# EAGLE board FINAL COMMON BOARD (EAGLE 9.5.2)
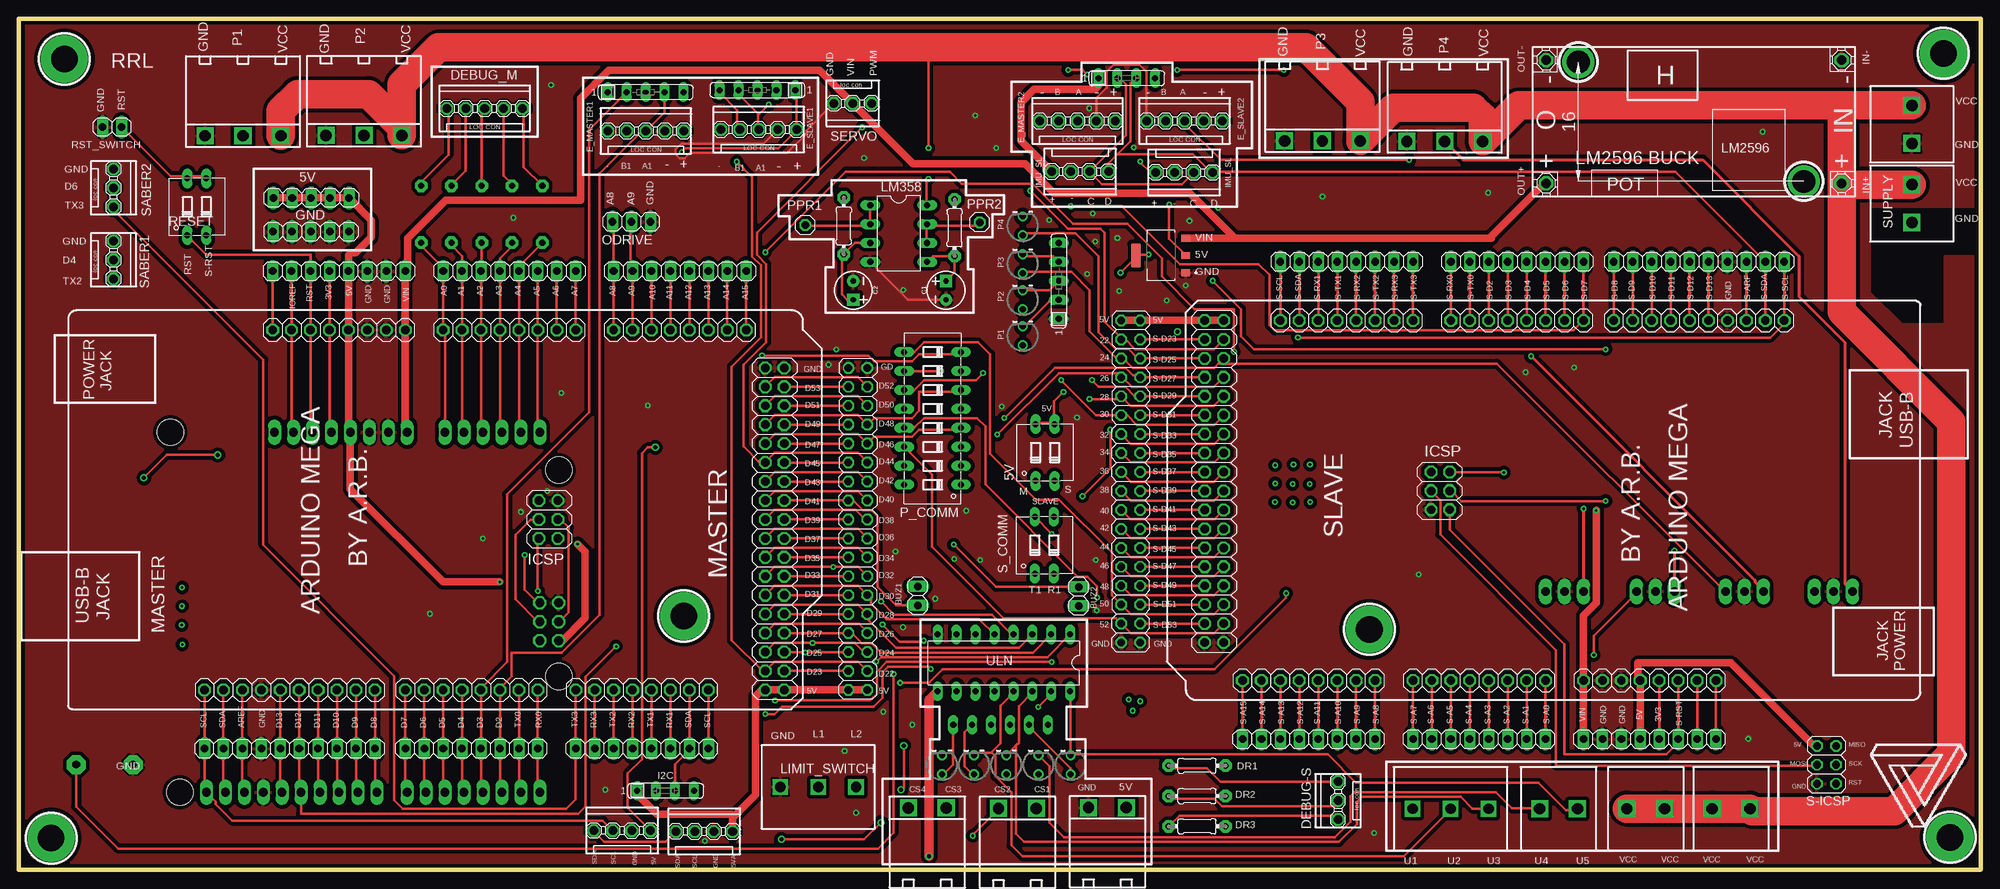
[diagram p2: board, top side]
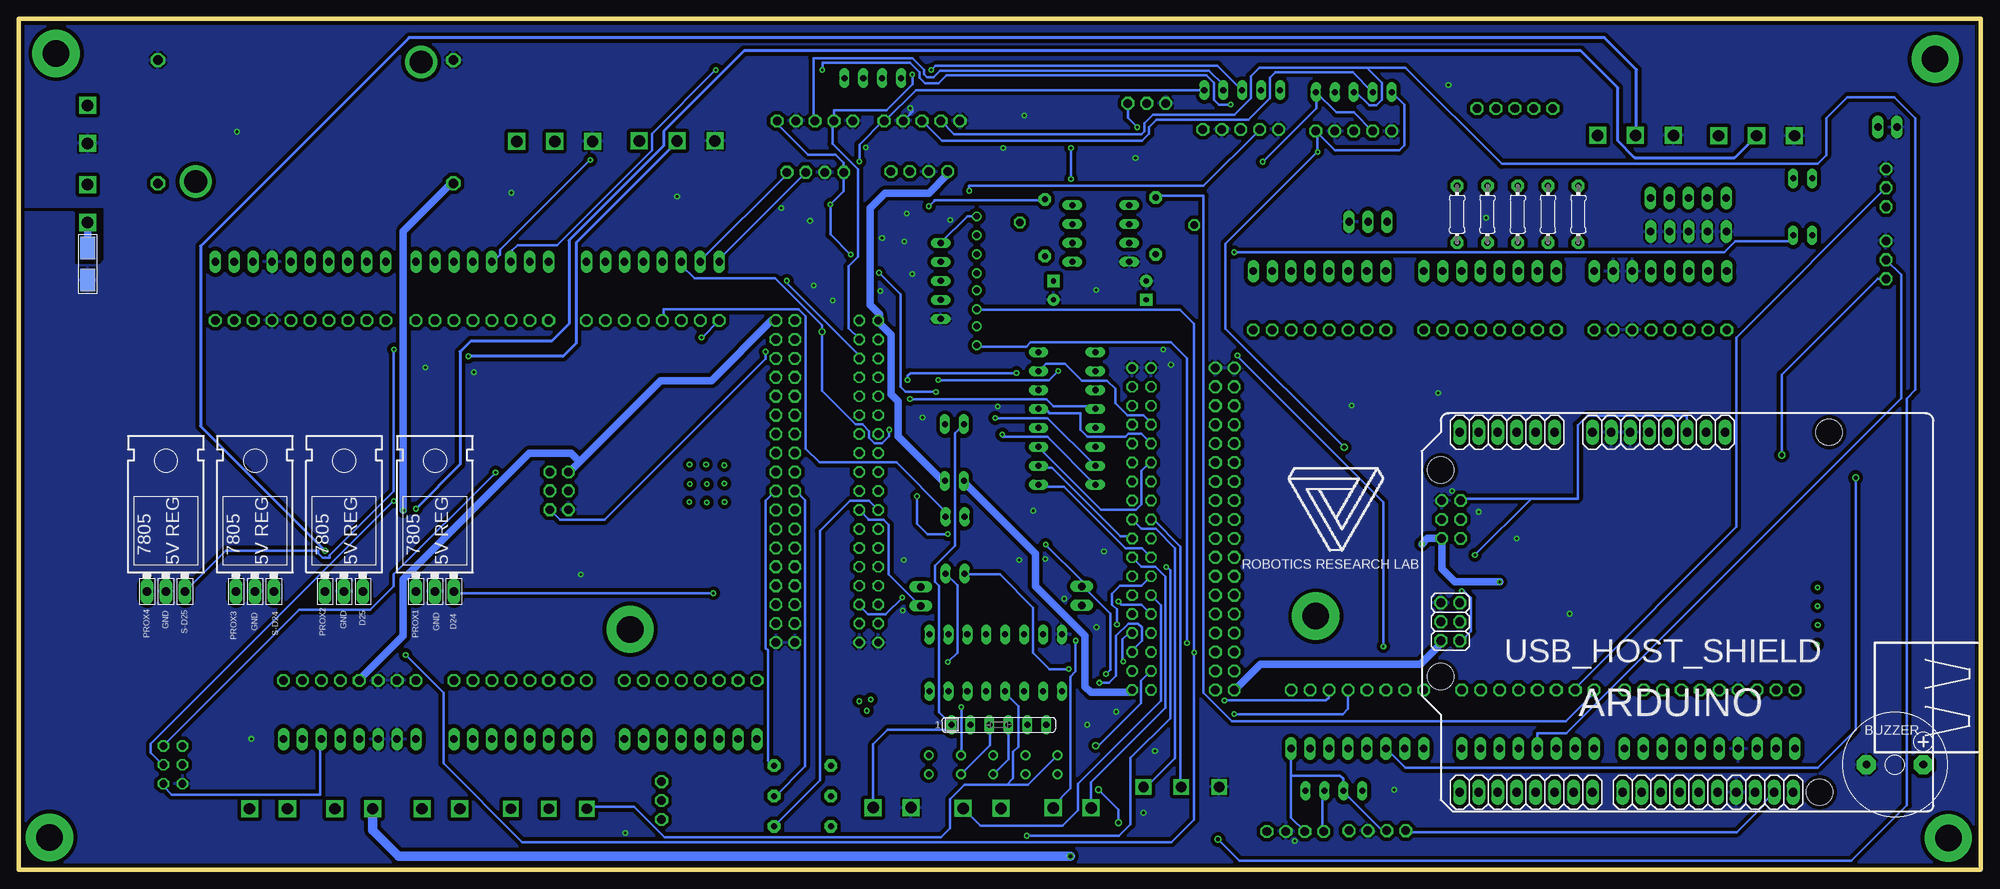
[diagram p3: board, bottom side, seen from below]

Size 263.12 x 114.12 mm. Coordinates in mm from the lower left corner, seen from the top.
Outline: 263.12,0 263.09,114.12 0,114.12 0.03,0 263.12,0
Copper layers (1*16): Top 0.035mm / dielectric 1.5mm / Bottom 0.035mm
Design rules "default *": minimum track width 10mil, minimum drill 0.35mm, track to track 12mil, track to pad 12mil, pad to pad 12mil, via to via 12mil, smd to smd 6mil, copper to edge 20mil, drill to drill 12mil, minimum pad ring 10mil, minimum via ring 8mil, stop-mask expansion 2mil, vias tented up to drill 0mil, thermal gap 10mil
Net classes: 0 default: width 0.127 mm, drill 0.279 mm, clearance 0.203 mm; 1 arduino master: width 0.305 mm, drill 0.356 mm, clearance 0.254 mm; 2 arduino slave: width 0.305 mm, drill 0.356 mm, clearance 0.254 mm; 3 proximity: width 0.406 mm, drill 0.381 mm, clearance 0.305 mm; 4 vin: width 1.016 mm, drill 0.356 mm, clearance 0.305 mm

## Footprints (pad centres in the part's own frame; a part is rotated, then mirrored left to right if it is on the bottom)
DIP02YL = drill 0.813 long: 1 -1.27,-3.81; 2 1.27,-3.81; 3 1.27,3.81; 4 -1.27,3.81
1X05 = drill 1.016 long: 1 -5.08,0; 2 -2.54,0; 3 0,0; 4 2.54,0; 5 5.08,0
1X02 = drill 1.016 long: 1 -1.27,0; 2 1.27,0
F/CM12P = drill 1.016 pad 2.54 octagon: + 3.81,0; - -3.81,0
CPOL-RADIAL-2.5MM-5MM = drill 0.7 pad 1.651 square: 1 1.25,0 | drill 0.7 pad 1.651: 2 -1.25,0
LED_3MM-NS = drill 0.813: A -1.27,0; K 1.27,0
AB_3PIN_LOC_CONNECTOR = drill 1.143 octagon: 1 -1.524,-2.54; 2 -1.524,0; 3 -1.524,2.54
AB_5PIN_LOC_CONNECTOR = drill 1.143 octagon: 1 -1.524,-5.08; 2 -1.524,-2.54; 3 -1.524,0; 4 -1.524,2.54; 5 -1.524,5.08
SIL4 = drill 0.813 long: 1 -3.81,0; 2 -1.27,0; 3 1.27,0; 4 3.81,0
AB_4PIN_LOC_CONNECTOR = drill 1.143 octagon: 1 0,-3.81; 2 0,-1.27; 3 0,1.27; 4 0,3.81
AB_SCREW_TER_5MM_3PIN = drill 1.397 square: 1 2.54,5.08; 2 2.54,0; 3 2.54,-5.08
DIL08 = drill 0.813 long: 1 -3.81,-3.81; 2 -1.27,-3.81; 3 1.27,-3.81; 4 3.81,-3.81; 5 3.81,3.81; 6 1.27,3.81; 7 -1.27,3.81; 8 -3.81,3.81
1X10 = drill 1.016 long: 1 -11.43,0; 2 -8.89,0; 3 -6.35,0; 4 -3.81,0; 5 -1.27,0; 6 1.27,0; 7 3.81,0; 8 6.35,0; 9 8.89,0; 10 11.43,0
1X08 = drill 1.016 long: 1 -8.89,0; 2 -6.35,0; 3 -3.81,0; 4 -1.27,0; 5 1.27,0; 6 3.81,0; 7 6.35,0; 8 8.89,0
2X18 = drill 1.016 octagon: 1 -21.59,-1.27; 2 -21.59,1.27; 3 -19.05,-1.27; 4 -19.05,1.27; 5 -16.51,-1.27; 6 -16.51,1.27; 7 -13.97,-1.27; 8 -13.97,1.27; 9 -11.43,-1.27; 10 -11.43,1.27; 11 -8.89,-1.27; 12 -8.89,1.27; 13 -6.35,-1.27; 14 -6.35,1.27; 15 -3.81,-1.27; 16 -3.81,1.27; 17 -1.27,-1.27; 18 -1.27,1.27; 19 1.27,-1.27; 20 1.27,1.27; 21 3.81,-1.27; 22 3.81,1.27; 23 6.35,-1.27; 24 6.35,1.27; 25 8.89,-1.27; 26 8.89,1.27; 27 11.43,-1.27; 28 11.43,1.27; 29 13.97,-1.27; 30 13.97,1.27; 31 16.51,-1.27; 32 16.51,1.27; 33 19.05,-1.27; 34 19.05,1.27; 35 21.59,-1.27; 36 21.59,1.27
AB_ARDUINO_MEGA = drill 1.13 octagon: 3V3 24.13,21.59; 5V 24.13,19.05; 5V1 -24.13,-36.83; 5V2 -24.13,-39.37; 5V3 -3.81,-9.017; - 24.13,29.21; A0 24.13,6.35; A1 24.13,3.81; A2 24.13,1.27; A3 24.13,-1.27; A4 24.13,-3.81; A5 24.13,-6.35; A6 24.13,-8.89; A7 24.13,-11.43; A8 24.13,-16.51; A9 24.13,-19.05; A10 24.13,-21.59; A11 24.13,-24.13; A12 24.13,-26.67; A13 24.13,-29.21; A14 24.13,-31.75; A15 24.13,-34.29; AREF -24.13,33.274; D2 -24.13,-1.27; D3 -24.13,1.27; D4 -24.13,3.81; D5 -24.13,6.35; D6 -24.13,8.89; D7 -24.13,11.43; D8 -24.13,15.494; D9 -24.13,18.034; D10 -24.13,20.574; D11 -24.13,23.114; D12 -24.13,25.654; D13 -24.13,28.194; D22 -21.59,-36.83; D23 -21.59,-39.37; D24 -19.05,-36.83; D25 -19.05,-39.37; D26 -16.51,-36.83; D27 -16.51,-39.37; D28 -13.97,-36.83; D29 -13.97,-39.37; D30 -11.43,-36.83; D31 -11.43,-39.37; D32 -8.89,-36.83; D33 -8.89,-39.37; D34 -6.35,-36.83; D35 -6.35,-39.37; D36 -3.81,-36.83; D37 -3.81,-39.37; D38 -1.27,-36.83; D39 -1.27,-39.37; D40 1.27,-36.83; D41 1.27,-39.37; D42 3.81,-36.83; D43 3.81,-39.37; D44 6.35,-36.83; D45 6.35,-39.37; D46 8.89,-36.83; D47 8.89,-39.37; D48 11.43,-36.83; D49 11.43,-39.37; D50 13.97,-36.83; D51 13.97,-39.37; D52 16.51,-36.83; D53 16.51,-39.37; GD3 19.05,-36.83; GD4 19.05,-39.37; GND 24.13,13.97; GND1 24.13,16.51; GND2 -24.13,30.734; GND5 1.245,-9.017; IOREF 24.13,26.67; MISO -3.81,-6.502; MOSI -1.295,-9.017; RST 24.13,24.13; RST1 1.245,-6.502; RX0 -24.13,-6.35; RX1 -24.13,-24.13; RX2 -24.13,-19.05; RX3 -24.13,-13.97; SCK -1.295,-6.502; SCL -24.13,-29.21; SCLU -24.13,38.354; SDA -24.13,-26.67; SDAU -24.13,35.814; TX0 -24.13,-3.81; TX1 -24.13,-21.59; TX2 -24.13,-16.51; TX3 -24.13,-11.43; VIN 24.13,11.43
1X03 = drill 1.016 long: 1 -2.54,0; 2 0,0; 3 2.54,0
AB_RIGHT_TER_BLK_3PIN = drill 1.524 square: 1 -5.588,5.08; 2 -5.588,0; 3 -5.588,-5.08
DIP08YL = drill 0.813 long: 1 -8.89,-3.81; 2 -6.35,-3.81; 3 -3.81,-3.81; 4 -1.27,-3.81; 5 1.27,-3.81; 6 3.81,-3.81; 7 6.35,-3.81; 8 8.89,-3.81; 9 8.89,3.81; 10 6.35,3.81; 11 3.81,3.81; 12 1.27,3.81; 13 -1.27,3.81; 14 -3.81,3.81; 15 -6.35,3.81; 16 -8.89,3.81
1X01 = drill 1.016 octagon: 1 0,0
SIL5 = drill 0.813 long: 1 -5.08,0; 2 -2.54,0; 3 0,0; 4 2.54,0; 5 5.08,0
0204/7 = drill 0.813 pad 1.676 octagon: 1 -3.81,0; 2 3.81,0
SIL6 = drill 0.813 long: 1 -6.35,0; 2 -3.81,0; 3 -1.27,0; 4 1.27,0; 5 3.81,0; 6 6.35,0
2X03 = drill 1.016 octagon: 1 -2.54,-1.27; 2 -2.54,1.27; 3 0,-1.27; 4 0,1.27; 5 2.54,-1.27; 6 2.54,1.27
AB_SCREW_TERMINAL_5MM_2PIN = drill 1.524 square: 1 0,2.54; 2 0,-2.54
AB_RIGHT_TER_BLK = drill 1.524 square: 1 -5.842,2.794; 2 -5.842,-2.286
SOT229P700X180-4N = smd 1.31 x 0.93: 1 -3.345,2.29; 2 -3.345,0; 3 -3.345,-2.29 | smd 1.31 x 3.24: 4 3.345,0
PLATED_DRILL_3.5MM = drill 3.556 pad 6.35: 1 0,0
AB_LM2596_BUCK_CONVERTER = drill 1.27 octagon: IN+ -19.304,6.35; IN- -19.304,-10.16; OUT+ 20.32,6.35; OUT- 20.32,-10.16 | drill 3.048 pad 4.318: P$1 -14.224,6.096; P$2 16.002,-9.906
AB_USB_HOST_SHIELD_ARDUINO = drill 1.143 long: 3V3 1.27,-24.13; 5V1 3.81,-24.13; - -6.35,-24.13; A0 16.51,-24.13; A1 19.05,-24.13; A2 21.59,-24.13; A3 24.13,-24.13; A4 26.67,-24.13; A5 29.21,-24.13; AREF -10.414,24.13; D2 24.13,24.13; D3 21.59,24.13; D4 19.05,24.13; D5 16.51,24.13; D6 13.97,24.13; D7 11.43,24.13; D8 7.366,24.13; D9 4.826,24.13; D10 2.286,24.13; D11 -0.254,24.13; D12 -2.794,24.13; D13 -5.334,24.13; GND -7.874,24.13; GND2 8.89,-24.13; GND3 6.35,-24.13; RST1 -1.27,-24.13; RX0 29.21,24.13; SCL -15.494,24.13; SDA -12.954,24.13; TX0 26.67,24.13; VIN 11.43,-24.13; VREF -3.81,-24.13 | drill 1.168 octagon: 5V 31.75,3.81; GND1 31.75,-1.27; MISO 29.21,3.81; MOSI 31.75,1.27; RST 29.21,-1.27; SCK 29.21,1.27 | hole 3.56: 31.75,-19.05; 31.75,8.636; -19.05,24.13; -20.32,-24.13
AB_7805_FLAT = drill 1.143 long: 1 -7.874,1.778; 2 -7.874,-0.762; 3 -7.874,-3.302
AB_JUMPER_ONE_WAY = smd 3.048 x 2.032: 1 -2.286,0; 2 2.032,0
DIL16 = drill 0.813 long: 1 -8.89,-3.81; 2 -6.35,-3.81; 3 -3.81,-3.81; 4 -1.27,-3.81; 5 1.27,-3.81; 6 3.81,-3.81; 7 6.35,-3.81; 8 8.89,-3.81; 9 8.89,3.81; 10 6.35,3.81; 11 3.81,3.81; 12 1.27,3.81; 13 -1.27,3.81; 14 -3.81,3.81; 15 -6.35,3.81; 16 -8.89,3.81

## Placement (x,y rotation side)
5V  [DIP02YL]  137.64,55.96 0 top
5V_ARRAY  [1X05]  39.22,90.09 0 top
BUZ1  [1X02]  120.55,36.73 270 top
BUZ2  [1X02]  142.14,36.68 270 top
BUZZER  F/CM12P  [F/CM12P]  11.53,14.12 0 bottom
C1  10uF  [CPOL-RADIAL-2.5MM-5MM]  124.36,77.7 90 top
C2  10uF  [CPOL-RADIAL-2.5MM-5MM]  111.91,77.7 270 top
D1  [LED_3MM-NS]  134.65,76.43 90 top
D2  [LED_3MM-NS]  134.65,81.25 90 top
D3  [LED_3MM-NS]  134.65,86.33 90 top
D6  [LED_3MM-NS]  141.07,14.1 90 top
D7  [LED_3MM-NS]  136.75,14.1 90 top
D8  [LED_3MM-NS]  132.44,14.1 90 top
D9  [LED_3MM-NS]  128.12,14.1 90 top
D10  [LED_3MM-NS]  123.8,14.1 90 top
D14  [LED_3MM-NS]  134.65,71.6 90 top
DEBUG-S  AB_3PIN_LOC_CONNECTOR  [AB_3PIN_LOC_CONNECTOR]  178.43,9.3 0 top
DEBUG_M  AB_5PIN_LOC_CONNECTOR  [AB_5PIN_LOC_CONNECTOR]  62.48,100.56 270 top
E_MASTER1  AB_5PIN_LOC_CONNECTOR  [AB_5PIN_LOC_CONNECTOR]  84.1,97.54 270 top
E_MASTER2  AB_5PIN_LOC_CONNECTOR  [AB_5PIN_LOC_CONNECTOR]  141.99,98.88 270 top
E_SLAVE1  AB_5PIN_LOC_CONNECTOR  [AB_5PIN_LOC_CONNECTOR]  99.24,97.74 270 top
E_SLAVE2  AB_5PIN_LOC_CONNECTOR  [AB_5PIN_LOC_CONNECTOR]  156.34,98.88 270 top
GND_ARRAY  [1X05]  39.19,85.57 0 top
I2C1P  [SIL4]  86.74,10.62 0 top
I2C2P  [SIL4]  148.59,106.15 0 top
IMU_BLOCK2  AB_4PIN_LOC_CONNECTOR  [AB_4PIN_LOC_CONNECTOR]  80.92,5.26 270 top
IMU_BLOCK3  AB_4PIN_LOC_CONNECTOR  [AB_4PIN_LOC_CONNECTOR]  142.34,93.62 90 top
IMU_BLOCK4  AB_4PIN_LOC_CONNECTOR  [AB_4PIN_LOC_CONNECTOR]  156.29,93.52 90 top
IMU_MASTER  AB_4PIN_LOC_CONNECTOR  [AB_4PIN_LOC_CONNECTOR]  91.92,5.16 270 top
LIMIT_SWITCH  AB_SCREW_TER_5MM_3PIN  [AB_SCREW_TER_5MM_3PIN]  107.21,13.67 270 top
LM358  [DIL08]  118.01,85.32 270 top
M1  [1X10]  36.35,16.26 180 top
M2  [1X08]  60.73,16.26 180 top
M3  [1X08]  83.59,16.26 180 top
M4  [2X18]  112.55,45.72 90 top
M5  [1X08]  88.67,80.26 0 top
M6  [1X08]  65.81,80.26 0 top
M7  [1X08]  42.95,80.26 0 top
MASTER  AB_ARDUINO_MEGA  [AB_ARDUINO_MEGA]  63.27,48.26 90 top
ODRIVE  [1X03]  82.17,86.89 180 top
P1  P1  [AB_RIGHT_TER_BLK_3PIN]  30.07,104.01 90 top
P2  P2  [AB_RIGHT_TER_BLK_3PIN]  46.3,104.06 90 top
P3  P3  [AB_RIGHT_TER_BLK_3PIN]  174.83,103.33 90 top
P4  P4  [AB_RIGHT_TER_BLK_3PIN]  191.24,103.25 90 top
P_COMM  [DIP08YL]  122.55,60.53 90 top
PPR1  [1X01]  105.46,86.44 270 top
PPR2  [1X01]  128.85,86.82 270 top
PROX_RES  [SIL5]  139.47,78.97 90 top
PULL_MASTER  [SIL5]  84.07,104.27 0 top
PULL_SLAVE  [SIL5]  99.06,104.55 180 top
R1  [0204/7]  125.5,86.08 90 top
R2  [0204/7]  53.97,87.91 270 bottom
R3  [0204/7]  110.64,86.33 270 top
R4  [0204/7]  58.04,87.91 270 bottom
R5  [0204/7]  62.1,87.91 270 bottom
R6  [0204/7]  66.17,87.91 270 bottom
R7  [0204/7]  70.23,87.91 270 bottom
R8  [0204/7]  158.01,13.97 0 top
R9  [0204/7]  158.01,9.91 0 top
R10  [0204/7]  158.01,5.84 0 top
RESET  [DIP02YL]  23.9,88.9 0 top
RN3  [SIL6]  131.67,19.46 0 bottom
RST_SWITCH  [1X02]  12.52,99.59 180 top
S1  [1X10]  225.32,81.53 0 top
S2  [1X08]  200.94,81.53 0 top
S5  [1X08]  173,17.53 180 top
S6  [1X08]  195.86,17.53 180 top
S7  [1X08]  218.72,17.53 180 top
S-3  [1X08]  178.08,81.53 0 top
S-4  [2X18]  149.12,52.07 270 top
S-ICSP  [2X03]  242.42,14.1 270 top
S_COMM  [DIP02YL]  137.54,43.54 0 top
SABER1  AB_3PIN_LOC_CONNECTOR  [AB_3PIN_LOC_CONNECTOR]  11.2,81.79 180 top
SABER2  AB_3PIN_LOC_CONNECTOR  [AB_3PIN_LOC_CONNECTOR]  11.2,91.44 180 top
SERVO  AB_3PIN_LOC_CONNECTOR  [AB_3PIN_LOC_CONNECTOR]  111.84,104.29 90 top
SLAVE  AB_ARDUINO_MEGA  [AB_ARDUINO_MEGA]  198.4,49.53 270 top
SUPPLY  AB_SCREW_TERMINAL_5MM_2PIN  [AB_SCREW_TERMINAL_5MM_2PIN]  253.87,89.33 0 top
SWITCH  AB_RIGHT_TER_BLK  [AB_RIGHT_TER_BLK]  145.75,2.51 270 top
SWITCH1  AB_RIGHT_TER_BLK  [AB_RIGHT_TER_BLK]  133.68,2.41 270 top
SWITCH2  AB_RIGHT_TER_BLK  [AB_RIGHT_TER_BLK]  121.59,2.46 270 top
U2  AMS1117  [SOT229P700X180-4N]  153.16,82.37 180 top
U$1  PLATED_DRILL_3.5MM  [PLATED_DRILL_3.5MM]  4.37,4.27 0 top
U$2  PLATED_DRILL_3.5MM  [PLATED_DRILL_3.5MM]  258.98,4.37 0 top
U$3  AB_LM2596_BUCK_CONVERTER  [AB_LM2596_BUCK_CONVERTER]  225.15,98.4 180 top
U$4  AB_USB_HOST_SHIELD_ARDUINO  [AB_USB_HOST_SHIELD_ARDUINO]  40.67,34.54 180 bottom
U$5  PLATED_DRILL_3.5MM  [PLATED_DRILL_3.5MM]  258.09,109.47 0 top
U$6  PLATED_DRILL_3.5MM  [PLATED_DRILL_3.5MM]  6.12,108.71 0 top
U$7  PLATED_DRILL_3.5MM  [PLATED_DRILL_3.5MM]  89.18,34.04 0 top
U$8  PLATED_DRILL_3.5MM  [PLATED_DRILL_3.5MM]  181.13,32.26 0 top
U$23  AB_7805_FLAT  [AB_7805_FLAT]  208.05,45.21 90 bottom
U$24  AB_7805_FLAT  [AB_7805_FLAT]  220.24,45.21 90 bottom
U$25  AB_7805_FLAT  [AB_7805_FLAT]  232.18,45.21 90 bottom
U$26  AB_7805_FLAT  [AB_7805_FLAT]  244.12,45.21 90 bottom
U$35  AB_JUMPER_ONE_WAY  [AB_JUMPER_ONE_WAY]  253.85,81.1 270 bottom
ULN  [DIL16]  132.11,27.76 180 top
ULN1  AB_SCREW_TERMINAL_5MM_2PIN  [AB_SCREW_TERMINAL_5MM_2PIN]  206.5,8.2 90 top
ULN2  AB_SCREW_TER_5MM_3PIN  [AB_SCREW_TER_5MM_3PIN]  192.02,5.66 90 top
ULN_SUPPLY  AB_SCREW_TERMINAL_5MM_2PIN  [AB_SCREW_TERMINAL_5MM_2PIN]  218.19,8.2 90 top
ULN_SUPPLY1  AB_SCREW_TERMINAL_5MM_2PIN  [AB_SCREW_TERMINAL_5MM_2PIN]  229.62,8.2 90 top
VCC-GND  AB_SCREW_TERMINAL_5MM_2PIN  [AB_SCREW_TERMINAL_5MM_2PIN]  253.87,99.95 0 top

## Tracks (layer width: path | path; a pad name or v marks a point on that pad's centre or on a via)
3V3A
  Top 0.305: M7.4 MASTER.3V3 41.68,58.93 U$4.3V3
5V  (via drill 0.35, 0.55 pad 0.7)
  Top 0.305: 5V.4 136.55,59.94 138.73,59.94 5V.3 138.84,59.84 138.84,62.8 v140.11,64.07 | U2.2 154.27,84.61 v154.27,89.22 | v151.54,82.49 150.44,82.49 150.33,82.37 U2.4 149.82,82.13 v147.75,80.06 | v150.38,94.98 150.38,94.88 151.74,93.52 IMU_BLOCK4.4 | IMU_BLOCK2.4 81.69,8.31 81.69,12.95 83.59,14.86 83.59,55.88 84.35,56.64 v85.37,56.64 | PULL_SLAVE.1 104.13,104.53 104.32,104.34 E_SLAVE1.5 104.32,99.16 101.9,96.75 89.43,96.75 v88.95,96.27
  Bottom 0.305: 5V.4 137.57,58.57 137.57,43.43 140.23,40.77 140.23,38.61 139.73,38.1 139.73,21.16 RN3.1 138.68,18.8 146.58,18.8 148.54,16.84 SWITCH.1 | v151.54,82.49 154.27,85.22 v154.27,89.22 152.49,90.99 152.49,93.51 IMU_BLOCK4.4 152.48,94.79 153.57,95.88 157.25,95.88 161.42,100.05 E_SLAVE2.5 | v150.38,94.98 150.38,97.23 147.21,100.41 E_MASTER2.5 146.95,100.41 142.81,104.55 PULL_SLAVE.1 | PULL_MASTER.1 77.31,102.58 77.31,97.15 77.98,96.48 86.6,96.48 E_MASTER1.5 88.95,98.83 v88.95,96.27 101.27,83.95 101.27,72.54 v85.37,56.64 | v147.75,80.06 144.87,77.18 144.87,64.77 144.17,64.07 v140.11,64.07
5VA  (via drill 0.36)
  Top 1.016: M4.1 M4.2 MASTER.5V2 MASTER.5V1 99.66,24.13 98.83,23.3 98.83,10.1 95.73,7 | IMU_MASTER.4 95.73,7 | 95.73,7 95.73,7.25 95.53,7.45 85.6,7.45 82.93,10.12 I2C1P.1 | 5V_ARRAY.1 5V_ARRAY.2 5V_ARRAY.3 5V_ARRAY.4 5V_ARRAY.5 47.27,87.12 47.27,84.78 45.21,82.73 44.58,82.73 44.22,82.37 M7.5 MASTER.5V 44.22,58.93 U$4.5V1 44.48,51.05 56.92,38.61 v64.53,38.61 | U$4.5V 72.92,30.73 75.97,33.78 75.97,42.67 v74.96,43.69
  Bottom 1.016: M4.1 114.14,23.81 119.34,23.81 120.1,24.57 120.1,31.37 126.77,38.04 126.77,42.38 136.37,51.98 5V.1 | MASTER.5V1 100.1,24.07 96.6,27.57 75.13,27.57 72.42,30.29 U$4.5V | v64.53,38.61 70.51,38.61 72.29,40.39 MASTER.5V3 74.19,44.45 v74.96,43.69
A0
  Top 0.305: U$4.A0 57.18,72.14 MASTER.A0 M6.1 56.92,80.71 53.98,83.65 R2.2
A1
  Top 0.305: U$4.A1 59.46,58.93 MASTER.A1 M6.2 59.46,82.3 58.04,83.72 R4.2
A2
  Top 0.305: U$4.A2 62,58.93 MASTER.A2 M6.3 62.1,80.37 R5.2
A3
  Top 0.305: U$4.A3 64.54,58.93 MASTER.A3 M6.4 64.54,81.98 66.17,83.6 R6.2
A4
  Top 0.305: U$4.A4 67.08,58.93 MASTER.A4 M6.5 67.08,80.95 R7.2
A5
  Top 0.305: M6.6 MASTER.A5 69.62,58.93 U$4.A5
A6
  Top 0.305: MASTER.A6 M6.7
A7
  Top 0.305: MASTER.A7 M6.8
A8
  Top 0.305: MASTER.A8 M5.1 79.78,86.74 ODRIVE.3
A9
  Top 0.305: MASTER.A9 M5.2 82.07,80.52 82.07,86.79 ODRIVE.2
A10
  Top 0.305: MASTER.A10 M5.3
A11
  Top 0.305: MASTER.A11 M5.4
A12
  Top 0.305: MASTER.A12 M5.5
A13
  Top 0.305: MASTER.A13 M5.6
A14
  Top 0.305: MASTER.A14 M5.7
A15
  Top 0.305: MASTER.A15 M5.8
AREF
  Top 0.305: MASTER.AREF M1.8 30,10.67 U$4.AREF
D2
  Top 0.305: U$4.D2 64.54,10.67 M2.3 MASTER.D2 64.54,24.38 66.13,25.97 66.13,29.15 72.8,29.15 77.88,34.23 77.88,93.42 83.52,99.06 E_MASTER1.3 86.61,101.57 PULL_MASTER.4
D3
  Top 0.305: U$4.D3 62,10.67 M2.4 MASTER.D3 62,24.38 65.49,27.88 65.49,50.35 76.5,61.37 76.5,99.21 81.53,104.24 PULL_MASTER.2
  Bottom 0.305: E_MASTER2.3 139.31,97.73 112.48,97.73 111.53,98.68 111.53,99.57 110.52,100.58 98.2,100.58 95.34,103.44 95.34,106.17 94.58,106.93 84.23,106.93 81.56,104.27 PULL_MASTER.2
D4
  Top 0.305: MASTER.D4 M2.5 59.46,10.67 U$4.D4
  Bottom 0.305: SABER1.2 10.69,79.76 10.69,63.23 55.58,18.35 59.46,18.35 M2.5
D5
  Top 0.305: MASTER.D5 M2.6 56.92,10.67 U$4.D5
D6
  Top 0.305: U$4.D6 54.38,10.67 M2.7 MASTER.D6
  Bottom 0.305: SABER2.2 32.79,71.37 32.79,45.97 54.38,24.38 MASTER.D6
D7
  Top 0.305: MASTER.D7 M2.8 51.84,10.67 U$4.D7
  Bottom 0.305: R3.1 110.43,90.36 104.23,90.36 104.23,23.75 100.42,19.94 55.65,19.94 51.84,23.75 MASTER.D7
D8
  Top 0.305: MASTER.D8 M1.1 47.78,10.67 U$4.D8
D9
  Top 0.305: MASTER.D9 M1.2 45.24,10.67 U$4.D9
D10
  Top 0.305: MASTER.D10 M1.3 42.7,10.67 U$4.D10
D11
  Top 0.305: MASTER.D11 M1.4 40.16,10.67 U$4.D11
D12  (via drill 0.36)
  Top 0.305: MASTER.D12 M1.5 37.62,10.67 U$4.D12 37.87,7.56 75.02,7.56 76,8.53 76,25.87 80.1,29.97 v80.12,29.97 | v99.68,68.96 99.71,68.94 113.97,68.94 114.71,68.2 119.79,68.2 120.74,69.15 126.37,69.15 P_COMM.8
  Bottom 0.305: v99.68,68.96 99.68,68.86 80.12,49.3 v80.12,29.97
D13
  Top 0.305: MASTER.D13 M1.6 35.08,10.67 U$4.D13
D22  (via drill 0.36)
  Top 0.305: M4.3 112.56,27.93 101.36,27.93 MASTER.D22 99.72,26.67 95.61,30.78 95.61,67.46 99.54,71.4 99.54,81.05 98.37,82.22 98.37,92.87 v96.32,94.93
  Bottom 0.305: v96.32,94.93 96.27,94.93 89.12,102.08 89.12,104.23 PULL_MASTER.5 86.43,101.54 84.04,101.54 E_MASTER1.2
D23  (via drill 0.55 pad 0.7)
  Top 0.305: MASTER.D23 M4.4 | v118.69,16.66 118.69,11.12 v118.32,10.74 | v115.62,6.32 113.39,4.09 v102.29,4.09
  Bottom 0.305: E_MASTER2.2 137.67,98.63 137.67,98.61 112.55,98.61 112.17,99 112.17,100.08 111.02,101.22 100.1,101.22 97.88,103.44 97.88,106.43 96.74,107.57 82.31,107.57 | PULL_MASTER.3 83.78,104.27 82,102.49 81.07,102.49 80.29,103.27 80.29,105.55 82.31,107.57 | M4.4 112.6,25.35 112.6,22.38 118.31,16.66 v118.69,16.66 | v118.32,10.74 115.62,8.05 v115.62,6.32 | v102.29,4.09 99.42,1.23 17.39,1.23 9.93,8.69 9.93,63.19 8.76,64.36 8.76,100.79 11.58,103.61 17.88,103.61 20.73,100.76 20.73,95.81 21.89,94.64 64.24,94.64 77.17,107.57 82.31,107.57
D24  (via drill 0.36)
  Top 0.305: MASTER.D24 101.36,30.46 106.45,30.46 | 106.45,30.46 112.08,30.46 113.33,29.21 M4.5 | v106.45,30.42 106.45,30.46 | v169.95,37.08 169.95,36.5 160.38,26.92 123.91,26.92 122.07,25.08 v118.2,25.08
  Bottom 0.305: D14.A 134.48,70.17 127.98,70.17 127.41,70.74 108.61,70.74 106.45,68.58 v106.45,30.42 | v169.95,37.08 204.75,37.08 U$23.3 | v118.2,25.08 116.93,25.08 115.98,26.03 115.98,31.37 114.31,33.03 113.03,33.03 112.51,32.51 112.51,30.71 113.82,29.4 M4.5
D25  (via drill 0.36)
  Top 0.305: MASTER.D25 105.5,29.21 | 105.5,29.21 M4.6 | v105.5,29.15 105.5,29.21 | v211.23,28.83 211.23,31.37 216.94,37.08 U$24.3
  Bottom 0.305: D1.A 134.61,75.12 107.4,75.12 105.5,73.21 v105.5,29.15 105.5,6.76 108.53,3.72 195.58,3.72 206.15,14.29 206.15,23.75 v211.23,28.83
D26  (via drill 0.36)
  Top 0.305: MASTER.D26 101.37,33.02 112.7,33.02 113.82,31.9 M4.7 | ULN.1 137.96,28.54 115.62,28.54 v115.02,27.94
  Bottom 0.305: v115.02,27.94 115.1,28.02 115.1,30.91 114.26,31.75 M4.7
D27
  Top 0.305: MASTER.D27 M4.8 111.79,31.75 113.12,30.42 114.39,30.42 115.66,29.15 136.03,29.15 ULN.2
D28
  Top 0.305: MASTER.D28 101.36,35.54 112.56,35.54 M4.9 113.82,33.59 117.63,29.78 134.14,29.78 135.92,31.56 ULN.3
D29  (via drill 0.36)
  Top 0.305: MASTER.D29 M4.10 | v115.65,35.99 117.41,34.23 130.49,34.23 133.15,31.57 ULN.4
  Bottom 0.305: v115.65,35.99 115.23,35.57 112.56,35.57 M4.10
D30
  Top 0.305: MASTER.D30 101.36,38.08 112.56,38.08 M4.11 114.33,36.32 114.33,35.7 116.41,33.62 128.79,33.62 ULN.5
D31
  Top 0.305: MASTER.D31 M4.12
  Bottom 0.305: SWITCH1.1 134.11,5.89 123.16,5.89 121.06,8 121.06,11.58 109.94,22.69 109.94,35.5 M4.12
D32  (via drill 0.36)
  Top 0.305: MASTER.D32 101.36,40.62 v109.25,40.62 | 112.56,40.62 M4.13 | v127.93,4.57 127.93,4.65 131.39,8.11 SWITCH1.2
  Top 0.356: v109.25,40.62 112.56,40.62
  Bottom 0.305: v109.25,40.62 109.12,40.62 108.67,40.18 108.67,20.36 114.01,15.02 114.01,6.12 115.56,4.57 v127.93,4.57
D33  (via drill 0.36)
  Top 0.305: MASTER.D33 M4.14 | v121.37,30.73 121.25,30.61 118.14,30.61 v115.85,32.89
  Bottom 0.305: v121.37,30.73 121.37,26.61 122.07,25.91 122.07,10.92 124.38,8.61 SWITCH2.1 | v115.85,32.89 115.85,34.92 116.5,35.57 116.5,37.05 115.43,38.11 112.53,38.11 M4.14
D34
  Top 0.305: MASTER.D34 101.36,43.16 112.56,43.16 M4.15
  Bottom 0.305: SWITCH2.2 119.3,11.75 109.31,21.74 109.31,39.31 110.66,40.65 112.56,40.65 M4.15
D35
  Top 0.305: MASTER.D35 M4.16
  Bottom 0.305: P_COMM.1 126.37,51.37 122.96,51.37 114.73,43.14 112.51,43.14 M4.16
D36
  Top 0.305: MASTER.D36 101.37,45.72 112.55,45.72 M4.17
  Bottom 0.305: P_COMM.2 126.37,53.91 124.55,53.91 115.34,44.7 114.07,44.7 M4.17
D37
  Top 0.305: MASTER.D37 M4.18
D38
  Top 0.305: MASTER.D38 101.38,48.27 112.21,48.27 113.49,46.99 M4.19
  Bottom 0.305: LIMIT_SWITCH.1 111.9,11.12 108.04,14.99 108.04,43.12 110.63,45.71 112.53,45.71 M4.19
D39
  Top 0.305: MASTER.D39 M4.20
  Bottom 0.305: LIMIT_SWITCH.2 107.32,11.23 107.32,43.34 110.96,46.99 M4.20
D40
  Top 0.305: MASTER.D40 101.36,50.78 112.56,50.78 M4.21
D41
  Top 0.305: MASTER.D41 M4.22 111.29,49.52 111.96,49.52 113.23,48.25 114.34,48.25 115.15,47.43 115.15,37.97 117.67,35.46 BUZ1.2
D42
  Top 0.305: MASTER.D42 101.36,53.32 112.56,53.32 M4.23
D43
  Top 0.305: MASTER.D43 M4.24
D44  (via drill 0.36)
  Top 0.305: M4.25 112.53,55.9 101.39,55.9 MASTER.D44 99.34,54.61 97.18,56.77 97.18,67.69 100.25,70.76 100.25,81.2 98.98,82.47 98.98,85.43 v113.12,99.57
  Bottom 0.305: SERVO.1 114.38,100.82 v113.12,99.57
D45
  Top 0.305: MASTER.D45 M4.26
  Bottom 0.305: P_COMM.3 126.37,56.68 117.96,48.27 113.31,48.27 113.31,48.3 112.59,49.02 112.59,53.49 111.47,54.61 M4.26
D46
  Top 0.305: MASTER.D46 101.36,58.4 112.56,58.4 M4.27 114.71,58.04 119.79,58.04 120.74,58.99 126.37,58.99 P_COMM.4
D47
  Top 0.305: MASTER.D47 M4.28
  Bottom 0.305: P_COMM.5 126.37,61.53 125.18,61.53 124.87,61.21 120.74,61.21 120.74,58.99 119.79,58.04 114.71,58.04 114.29,58.46 112.55,58.46 111.28,57.19 M4.28
D48
  Top 0.305: MASTER.D48 101.36,60.94 112.56,60.94 M4.29 114.71,60.58 119.79,60.58 120.74,61.53 120.74,64.07 126.37,64.07 P_COMM.6
D49
  Top 0.305: MASTER.D49 M4.30
  Bottom 0.305: P_COMM.7 125.37,67.87 122.81,67.87 120.52,65.58 117.16,65.58 116.07,64.48 116.07,62.57 114.44,60.95 112.29,60.95 111.28,59.93 M4.30
D50
  Top 0.305: MASTER.D50 101.39,63.52 112.53,63.52 M4.31
D51
  Top 0.305: MASTER.D51 M4.32
D52
  Top 0.305: MASTER.D52 101.36,66.02 112.56,66.02 M4.33
D53
  Top 0.305: MASTER.D53 M4.34
GND  (via drill 0.35, 0.36)
  Top 0.305: C1.2 119.26,76.45 LM358.4 | E_MASTER2.4 144.53,103.51 145.9,104.88 145.9,106.98 146.84,107.92 150.32,107.92 151.26,106.99 E_SLAVE2.1 | SERVO.3 105.63,99.1 105.63,98.72 103.05,96.14 90.01,96.14 89.3,95.43 88.6,95.43 88.12,95.92 88.12,96.61 88.86,97.36 99.87,97.36 E_SLAVE1.4
  Bottom 0.305: 143.28,101.65 143.28,102.11 | E_MASTER2.4 143.54,101.4 v143.54,102.11
  other vias: 149.5,96.85 160.83,88.72 157,87.02 153.95,76.33 144.45,41.55 131.83,62.13 127.05,48.16 117.58,42.7 141.91,60.66 233.83,98.96 202.08,66.73 84.35,62.28 128.3,101.14 72.77,63.93 113.36,95.43 181.79,4.95 70.89,50.8 67.34,48.01 62.26,44.45 122.91,36.35 118.59,32.54 128.96,41.53 125.45,41.68 156.49,78.36 92.02,3.86 108.61,67.72 109.63,69.77 187.73,39.62 144.55,34.8 147.6,77.6 143.28,79.88 144.37,84.25 147.35,84.71 144.04,88.01 71.4,105.21 208.56,67.36 112.29,7.67 55.14,34.34 66.32,87.43 231.93,17.58 118.64,77.72 131.09,96.77 138.2,87.12 174.83,90.3 197.03,90.78 78.69,10.74 110.74,15.93 115.95,21.21 119.81,19.46
  pour Top (isolate 0.508): 263.17,88.9 248.18,88.9 248.18,77.47 252.5,73.15 258.34,73.15 258.34,82.3 263.12,82.3 263.12,0 0.03,0 0.03,114.12 263.17,114.12
  pour Bottom (isolate 0.508): 251.49,88.9 263.17,88.9 263.17,114.12 0.03,114.12 0.03,0 263.12,0 263.12,88.14 255.8,88.14 255.8,81.08 252.2,81.08 251.49,81.79
GND_J
  Bottom 1.016: SUPPLY.2 253.87,83.41 U$35.1
MISO  (via drill 0.36)
  Top 0.305: v69.62,37.4 69.62,44.45 MASTER.MISO
  Bottom 0.305: v69.62,37.4 69.29,37.4 68.35,36.46 68.35,32 69.62,30.73 U$4.MISO
MOSI
  Top 0.305: MASTER.MOSI 72.69,46.96 73.75,45.91 73.75,34.54 72.48,33.27 U$4.MOSI
N$2
  Top 0.305: LM358.5 122.58,82.27 R1.1 125.5,80.09 C1.1
N$3
  Top 0.305: MASTER.- M7.1
N$4
  Top 0.305: SLAVE.- S7.1
N$5  (via drill 0.35)
  Top 0.305: v125.4,43.61 v125.41,43.62 131.09,37.95 BUZ2.1 | v117.31,26.29 117.31,4.95 115.21,2.86 13.36,2.86 7.72,8.5 BUZZER.+
  Bottom 0.305: v125.4,43.61 120.55,38.76 BUZ1.1 120.41,38 120.4,38.01 116.74,34.35 116.74,26.86 v117.31,26.29
N$6
  Top 0.305: C2.1 111.09,76.45 110.39,77.15 110.39,82.27 R3.2 112.17,84.05 LM358.3
N$7
  Top 0.305: 22.63,92.96 25.17,92.96 RESET.3 | 22.63,92.96 21.36,92.96 21.36,92.99 20.4,92.99 RST_SWITCH.1 | 22.63,92.96 RESET.4
N$8  (via drill 0.36)
  other vias: 148.87,22.86
N$9  (via drill 0.36)
  other vias: 149.38,21.34
N$10  (via drill 0.36)
  other vias: 150.39,22.61
N$11
  Top 0.305: DEBUG_M.1 57.65,101.84 57.65,95.85 53.98,92.18 R2.1
N$12
  Top 0.305: RN3.2 135.48,19.23 141.07,13.64 D6.A
N$13
  Bottom 0.305: RN3.3 132.87,19.38 132.87,16.71 D7.A
N$14
  Bottom 0.305: RN3.4 130.4,14.83 132.41,12.83 D8.A
N$15
  Top 0.305: D9.A 127.91,12.83 126.83,13.91 126.83,18.43 RN3.5
N$16
  Top 0.305: D10.A 124.04,12.83 125.32,14.11 RN3.6
N$17  (via drill 0.35)
  other vias: 168.5,51.79
N$18  (via drill 0.35)
  other vias: 170.81,51.71
N$19  (via drill 0.35)
  other vias: 173.1,51.71
N$20  (via drill 0.35)
  other vias: 168.45,49.3
N$21  (via drill 0.35)
  other vias: 170.84,49.25
N$22
  Top 0.305: DEBUG_M.2 59.94,93.76 58.04,91.86 R4.1
N$23
  Top 0.305: DEBUG_M.3 62.1,101.7 R5.1
N$24
  Top 0.305: R6.1 66.17,91.97 65.05,93.09 65.05,102.06 DEBUG_M.4
N$25
  Top 0.305: R7.1 67.72,94.23 67.72,101.93 DEBUG_M.5
N$27  (via drill 0.35)
  other vias: 173.2,49.3
N$28  (via drill 0.35)
  other vias: 168.5,54.25
N$29  (via drill 0.35)
  other vias: 170.94,54.36
N$30  (via drill 0.35)
  other vias: 173.15,54.33
N$31  (via drill 0.35)
  other vias: 21.92,37.87
N$32  (via drill 0.35)
  other vias: 21.92,35.36
N$33  (via drill 0.35)
  other vias: 21.87,32.82
N$34  (via drill 0.35)
  other vias: 21.95,30.23
N$42
  Top 0.305: DEBUG-S.3 161.16,11.84 159.35,13.65 154.52,13.65 R8.1
N$43
  Top 0.305: DEBUG-S.2 176.91,8.51 161.38,8.51 160.43,9.46 160.43,9.52 154.58,9.52 R9.1
N$44
  Top 0.305: R10.1 155.63,7.26 176.4,7.26 DEBUG-S.1
N$63
  Top 0.305: SLAVE.IOREF S7.2
O1
  Top 0.305: D14.K 134.87,72.87 138.14,76.14 139.47,76.14 PROX_RES.2
O2
  Top 0.305: D1.K 138.2,77.7 PROX_RES.3
O3
  Top 0.305: D2.K 134.9,82.27 138.71,82.27 PROX_RES.4
O4
  Bottom 0.305: PROX_RES.5 135.92,87.6 D3.K
OUTPUT1
  Top 0.305: LM358.1 114.14,89.06 114.14,86.65 LM358.2 113.97,86.36 105.54,86.36 PPR1.1
OUTPUT2
  Top 0.305: LM358.6 121.75,84.11 121.75,86.52 LM358.7 122.05,86.36 128.8,86.36 128.85,86.41 PPR2.1
PROX1  (via drill 0.38)
  Top 0.406: v209.84,48.44 209.82,48.41 209.82,37.35 U$23.1
  Bottom 0.406: v209.84,48.44 203.92,54.36 203.92,69.47 202.5,70.89 191.64,70.89 189.32,73.21 189.32,84.39 176.62,97.09 176.62,99 165.82,109.79 53.63,109.79 48.67,104.83 48.67,97.73 46.44,95.5 32.99,95.5 P1.2
PROX2  (via drill 0.38)
  Top 0.406: v222.02,42.8 U$24.1
  Bottom 0.406: v222.02,42.8 238.72,59.5 238.72,83.63 210.78,111.57 50.47,111.57 46.19,107.29 46.19,98.59 P2.2
PROX3  (via drill 0.38)
  Top 0.406: U$25.1 233.96,37.46 232.82,38.61 232.82,38.86 v202.82,68.86
  Bottom 0.406: P3.2 174.83,97.61 188.37,84.07 188.37,70.61 190.12,68.86 v202.82,68.86
PROX4
  Top 0.406: U$26.1 244.88,38.35 244.88,70.74 238.72,76.9 238.72,82.3 225.83,95.19 193.71,95.19 P4.2
RST  (via drill 0.36)
  Top 0.305: U$4.RST1 39.14,58.93 MASTER.RST M7.3 39.14,82.49 25.17,82.49 22.63,85.03 RESET.1 | v67.84,42.23 67.84,37.59 69.62,35.81 U$4.RST
  Bottom 0.305: 60.29,49.78 54.06,49.78 54.06,59.63 52.79,60.9 39.46,60.9 39.46,58.67 U$4.RST1 | v67.84,42.23 60.29,49.78 | 60.29,49.78 69.49,49.78 MASTER.RST1
RX0
  Top 0.305: MASTER.RX0 M2.1 69.62,10.67 U$4.RX0
RX1  (via drill 0.36)
  Top 0.305: MASTER.RX1 M3.3 | v101.44,22.72 114.19,22.72 115.09,23.62 115.09,26.58 116.38,27.88 v138.52,27.88
  Bottom 0.305: S_COMM.2 137.25,38.16 137.25,29.1 138.47,27.88 v138.52,27.88 | MASTER.RX1 87.4,23.11 87.8,22.72 v101.44,22.72
RX2
  Top 0.305: MASTER.RX2 M3.5
RX3
  Top 0.305: MASTER.RX3 M3.7
S-3V3
  Top 0.305: SLAVE.3V3 S7.4
S-5V
  Top 1.016: SLAVE.5V1 SLAVE.5V2 S-4.2 S-4.1 | S7.5 SLAVE.5V 217.13,25.72 217.13,27.75 229.58,27.75 240.69,16.64 S-ICSP.1 | IMU_BLOCK3.4 134.39,97.76 134.39,102.87 136.17,104.65 144.3,104.65 144.78,105.13 I2C2P.1
  Bottom 1.016: 5V.2 139.2,52.15 145.19,58.13 145.19,62.8 146.14,63.75 146.14,71.75 147.85,73.47 S-4.1 147.68,73.83 147.68,74.51 148.95,75.77 148.95,88.72 146.93,90.74 141.02,90.74 138.53,93.23 IMU_BLOCK3.4 | 187.92,54.74 177.05,65.61 170.19,65.61 162.14,73.66 SLAVE.5V1 | SLAVE.5V3 189.32,53.34 187.92,54.74 | SLAVE.5V 217.45,25.46 211.54,31.37 211.54,38.99 194.67,55.87 189.05,55.87 187.92,54.74
S-A0
  Top 0.305: SLAVE.A0 S6.1
S-A1
  Top 0.305: SLAVE.A1 S6.2
S-A2
  Top 0.305: SLAVE.A2 S6.3
S-A3
  Top 0.305: SLAVE.A3 S6.4
S-A4
  Top 0.305: SLAVE.A4 S6.5
S-A5
  Top 0.305: SLAVE.A5 S6.6
S-A6
  Top 0.305: SLAVE.A6 S6.7
S-A7
  Top 0.305: SLAVE.A7 S6.8
S-A8
  Top 0.305: SLAVE.A8 S5.1
S-A9
  Top 0.305: SLAVE.A9 S5.2
S-A10
  Top 0.305: SLAVE.A10 S5.3
S-A11
  Top 0.305: SLAVE.A11 S5.4
S-A12
  Top 0.305: SLAVE.A12 S5.5
S-A13
  Top 0.305: SLAVE.A13 S5.6
S-A14
  Top 0.305: SLAVE.A14 S5.7
S-A15
  Top 0.305: SLAVE.A15 S5.8
S-AREF
  Top 0.305: S1.8 SLAVE.AREF
S-D2  (via drill 0.36)
  Top 0.305: S2.3 SLAVE.D2 | 99.15,101.17 99.15,99.26 E_SLAVE1.3 | 99.15,101.17 99.15,101.35 96.52,103.97 PULL_SLAVE.4 | v100.58,102.6 99.15,101.17 | v169.63,107.25 v155.35,107.25
  Bottom 0.305: v100.58,102.6 102.18,102.6 102.81,103.23 102.81,105.51 103.85,106.55 138.68,106.55 139.8,105.43 141.59,105.43 142.33,106.17 142.33,106.93 143.6,108.2 155.35,108.2 v155.35,107.25 | v169.63,107.25 178.21,98.68 178.21,96.46 190.91,83.76 196.24,83.76 196.94,83.06 196.94,81.53 S2.3
S-D3  (via drill 0.36)
  Top 0.305: S2.4 SLAVE.D3 | v186.46,95.19 161.19,95.19 156.34,100.04 E_SLAVE2.3
  Bottom 0.305: PULL_SLAVE.2 101.59,104.56 101.59,105.24 103.51,107.16 139.56,107.16 140.42,106.3 141.31,106.3 141.69,106.68 141.69,107.25 143.28,108.84 156.55,108.84 156.55,100.62 E_SLAVE2.3 | v186.46,95.19 198.53,83.12 198.53,82.49 199.48,81.53 S2.4
S-D4
  Top 0.305: S2.5 SLAVE.D4
S-D5
  Top 0.305: S2.6 SLAVE.D5
S-D6
  Top 0.305: S2.7 SLAVE.D6
S-D7  (via drill 0.36)
  Top 0.305: v141.06,88.96 147.98,88.96 155.73,81.22 166.27,81.22 167.73,79.76 167.73,73 168.4,72.33 208.5,72.33 SLAVE.D7 S2.8
  Bottom 0.305: v141.06,88.96 140.3,89.73 140.3,89.79 125.5,89.79 R1.2
S-D8
  Top 0.305: SLAVE.D8 S1.1
S-D9
  Top 0.305: S1.2 SLAVE.D9
S-D10
  Top 0.305: S1.3 SLAVE.D10
S-D11
  Top 0.305: S1.4 SLAVE.D11
S-D12
  Top 0.305: S1.5 SLAVE.D12
S-D13
  Top 0.305: S1.6 SLAVE.D13
S-D22  (via drill 0.36)
  Top 0.305: SLAVE.D22 160.28,69.83 149.67,69.83 148.39,71.12 S-4.3 147.85,71.25 145.62,73.48 145.62,85.42 145.06,85.98 140.74,85.98 v135.66,91.06 | PULL_SLAVE.5 93.98,104.23 96.35,101.85 96.35,99.57 96.66,99.26 E_SLAVE1.2
  Bottom 0.305: v135.66,91.06 135.66,91.69 104.23,91.69 96.7,99.22 E_SLAVE1.2
S-D23  (via drill 0.36)
  Top 0.305: S-4.4 SLAVE.D23 | v140.74,107.25 142.65,107.25 v143.28,106.62
  Bottom 0.305: PULL_SLAVE.3 102.34,107.82 140.16,107.82 140.73,107.25 v140.74,107.25 | v143.28,106.62 143.27,106.6 143.27,105.36 146.77,101.85 153.76,101.85 153.76,100.44 E_SLAVE2.2 154.01,100.19 154.01,97.35 150.58,93.92 150.58,82.17 151.85,80.9 151.85,72.64 150.39,71.18 S-4.4
S-D24
  Top 0.305: 160.97,67.98 160.32,67.33 149.34,67.33 148.08,68.58 S-4.5 147.24,68.58 143.61,72.21 143.61,77.72 141.17,80.16 134.82,80.16 D2.A | 160.97,67.98 SLAVE.D24 | U$25.3 228.75,37.34 198.21,67.88 161.06,67.88 160.97,67.98
S-D25  (via drill 0.36)
  Top 0.305: SLAVE.D25 S-4.6 150.05,68.58 148.79,69.84 147.08,69.84 144.81,72.11 144.81,82.3 141.73,85.37 134.95,85.37 D3.A | v160.11,78.99 163.92,75.18 163.92,71.53 165.66,69.79 v212.81,69.79
  Bottom 0.305: U$26.3 235.36,42.8 222.97,42.8 222.97,42.48 222.34,41.85 221.39,41.85 221.39,42.16 212.81,50.74 v212.81,69.79 | v160.11,78.99 160.11,78.66 150.58,69.14 150.58,68.77 S-4.6
S-D26  (via drill 0.36)
  Top 0.305: SLAVE.D26 160.29,64.76 149.26,64.76 147.98,66.04 S-4.7 147.73,66.17 147.73,66.61 139.47,66.61 v131.22,58.36
  Bottom 0.305: v131.22,58.36 131.22,58.04 125.18,58.04 118.78,51.64 P_COMM.16
S-D27  (via drill 0.36)
  Top 0.305: SLAVE.D27 S-4.8 150.14,66.04 149.89,66.29 149.44,66.29 148.39,67.35 138.94,67.35 v132.17,60.58
  Bottom 0.305: P_COMM.15 125.15,60.58 v132.17,60.58
S-D28  (via drill 0.36)
  Top 0.305: SLAVE.D28 161.54,63.5 160.29,62.25 149.11,62.25 S-4.9 147.47,63.12 v143.6,63.12
  Bottom 0.305: P_COMM.12 119.13,62.18 124.36,62.18 125.3,63.12 v143.6,63.12
S-D29  (via drill 0.36)
  Top 0.305: SLAVE.D29 S-4.10 149.64,63.5 148.39,64.76 144.82,64.76 v143.92,65.66 | P_COMM.11 120.05,64.34 121.37,65.66 128.37,65.66 128.37,65.67 v129.31,66.61
  Bottom 0.305: v129.31,66.61 143.54,66.61 143.92,66.23 v143.92,65.66
S-D30  (via drill 0.36)
  Top 0.305: SLAVE.D30 160.32,59.71 149.92,59.71 148.66,60.96 S-4.11 144.49,60.96 v139.79,65.66 | v123.72,66.87 123.71,66.88 P_COMM.10
  Bottom 0.305: v139.79,65.66 124.93,65.66 v123.72,66.87
S-D31
  Top 0.305: S-4.12 SLAVE.D31
S-D32
  Top 0.305: S-4.13 149.11,57.17 160.32,57.17 SLAVE.D32
S-D33
  Top 0.305: S-4.14 SLAVE.D33
S-D34
  Top 0.305: S-4.15 147.9,55.88 149.16,54.63 160.32,54.63 SLAVE.D34
S-D35
  Top 0.305: S-4.16 SLAVE.D35
S-D36
  Top 0.305: S-4.17 149.12,52.07 160.3,52.07 SLAVE.D36
S-D37
  Top 0.305: SLAVE.D37 S-4.18
S-D38
  Top 0.305: S-4.19 149.14,49.51 160.28,49.51 SLAVE.D38
  Bottom 0.305: R8.2 162.01,13.97 162.65,14.6 162.65,29.43 162.97,29.74 162.97,49.47 161.63,50.8 SLAVE.D38
S-D39
  Top 0.305: S-4.20 SLAVE.D39
  Bottom 0.305: R9.2 161.63,9.91 157.67,13.87 157.67,49.57 158.9,50.8 SLAVE.D39
S-D40
  Top 0.305: S-4.21 149.11,47.01 160.32,47.01 SLAVE.D40
  Bottom 0.305: R10.2 155.66,12 155.66,45.47 151.64,49.49 149.09,49.49 S-4.21
S-D41
  Top 0.305: SLAVE.D41 S-4.22
  Bottom 0.305: BUZ2.2 142.24,35.41 146.46,39.62 146.46,46.29 147.12,46.95 149.12,46.95 149.12,46.99 S-4.22
S-D42
  Top 0.305: S-4.23 149.12,44.45 160.3,44.45 SLAVE.D42
S-D43
  Top 0.305: S-4.24 SLAVE.D43
S-D44
  Top 0.305: S-4.25 149.14,41.89 160.28,41.89 SLAVE.D44
S-D45
  Top 0.305: SLAVE.D45 S-4.26
S-D46
  Top 0.305: S-4.27 149.15,39.34 160.27,39.34 SLAVE.D46
S-D47
  Top 0.305: S-4.28 SLAVE.D47
S-D48
  Top 0.305: S-4.29 149.14,36.81 160.28,36.81 SLAVE.D48
S-D49
  Top 0.305: S-4.30 SLAVE.D49
S-D50
  Top 0.305: SLAVE.D50 160.3,34.29 149.12,34.29 S-4.31 146.58,36.83 146.58,42.57 139.5,49.66 136.42,49.66 130.26,55.82 130.26,69.16 130.25,69.16 128.68,70.74 121.37,70.74 120.05,69.42 P_COMM.9
S-D51  (via drill 0.36)
  Top 0.305: S-4.32 SLAVE.D51 | P_COMM.13 120.05,59.26 121.37,60.58 128.51,60.58 129.63,59.46 129.63,51.69 142.01,39.31 143.34,39.31 144.61,38.04 v144.61,36.51
  Bottom 0.305: v144.61,36.51 146.88,34.25 149.25,34.25 150.39,35.39 S-4.32
S-D52
  Top 0.305: SLAVE.D52 160.28,31.73 149.14,31.73 S-4.33 147.13,33.74 132.04,33.74 122.47,43.32 122.47,53 P_COMM.14
S-D53
  Top 0.305: S-4.34 SLAVE.D53
S-MISO  (via drill 0.36)
  Top 0.305: v199.16,53.28 199.1,53.34 SLAVE.MISO
  Bottom 0.305: v199.16,53.28 212.81,39.62 212.81,38.04 215.99,34.86 225.51,34.86 243.69,16.69 S-ICSP.2
S-MOSI
  Top 0.305: S-ICSP.3 241.02,13.97 206.15,13.97 206.15,29.46 190.64,44.97 190.64,49.57 SLAVE.MOSI
S-RST  (via drill 0.36)
  Top 0.305: SLAVE.RST S7.3 222.53,17.08 220.94,15.49 207.29,15.49 207.29,30.25 191.92,45.62 191.92,48.26 SLAVE.RST1 | v100.1,82.8 110.9,93.6 124.87,93.6 126.45,92.01 135.98,92.01 141.38,86.61 148.68,86.61 153.31,81.98 153.31,79.57 157.7,75.18 162.97,75.18 v162.97,69.47
  Bottom 0.305: S-ICSP.6 243.69,11.19 242.6,10.1 222.66,10.1 222.66,17.4 S7.3 | v100.1,82.8 100.08,82.78 34.4,82.78 32.92,84.26 25.17,84.26 RESET.2 | v162.97,69.47 162.97,68.52 184.56,46.93 190.54,46.93 SLAVE.RST1
S-RX0
  Top 0.305: S2.1 SLAVE.RX0
S-RX1  (via drill 0.36, 0.55 pad 0.7)
  Top 0.305: S-3.3 SLAVE.RX1 | v142.65,50.1 146.38,53.83 v146.38,59.02 | v138.52,45.02 138.52,45.1 S_COMM.4
  Bottom 0.305: v138.52,45.02 141.25,45.02 142.65,46.42 v142.65,50.1 | v146.38,59.02 146.41,58.99 146.41,58.14 147.35,57.2 148.36,57.2 149.07,57.91 149.07,58.82 149.99,59.74 150.9,59.74 155.4,64.24 v155.4,72.14 155.4,73.01 161.7,79.31 172.49,79.31 174.27,81.09
  Bottom 0.406: S-3.3 174.27,81.09
S-RX2
  Top 0.305: S-3.5 SLAVE.RX2
S-RX3
  Top 0.305: S-3.7 SLAVE.RX3
S-SCK  (via drill 0.36)
  Top 0.305: v212.81,49.47 212.79,49.44 193.47,49.44 192.09,50.82 SLAVE.SCK
  Bottom 0.305: v212.81,49.47 245.39,16.89 245.39,15.68 243.8,14.1 S-ICSP.4
S-SCL  (via drill 0.36)
  Top 0.305: S1.10 SLAVE.SCLU 236.75,73.21 234.91,71.37 v171.54,71.37 | S-3.1 SLAVE.SCL | I2C2P.2 147.62,106.15 148.46,105.31 148.46,98.47 IMU_BLOCK3.2 145.29,91.95 155.98,91.95 IMU_BLOCK4.2
  Bottom 0.305: IMU_BLOCK4.2 169,82.08 169,81.53 S-3.1 | SLAVE.SCL 171.48,71.37 v171.54,71.37
S-SDA
  Top 0.305: SLAVE.SDAU S1.9 234.2,81.55 234.19,81.55 222.16,93.57 160.15,93.57 IMU_BLOCK4.1 159.87,93.52 157.44,95.95 147.37,95.95 | S-3.2 SLAVE.SDA | 147.37,95.95 149.09,97.67 149.09,105.44 149.8,106.15 I2C2P.3 | 147.37,95.95 146.15,94.73 IMU_BLOCK3.1
  Bottom 0.305: S-3.2 171.73,81.66 160.1,93.29 IMU_BLOCK4.1
S-TX0
  Top 0.305: S2.2 SLAVE.TX0
S-TX1
  Top 0.305: S-3.4 SLAVE.TX1
  Bottom 0.305: S_COMM.3 138.81,48.04 145.39,54.62 155.73,54.62 157.57,56.46 157.57,74.23 158.52,75.18 176.62,75.18 176.62,73.85 SLAVE.TX1
S-TX2
  Top 0.305: S-3.6 SLAVE.TX2
S-TX3
  Top 0.305: S-3.8 SLAVE.TX3
SCK
  Top 0.305: MASTER.SCK 68.64,46.96 66.64,44.96 66.64,36.26 69.62,33.27 U$4.SCK
SCL
  Top 0.305: MASTER.SCL M3.1 | MASTER.SCLU M1.10 24.92,10.67 U$4.SCL 26.44,9.14 26.44,8.83 28.66,6.6 78.31,6.6 IMU_BLOCK2.2
  Bottom 0.305: IMU_MASTER.2 92.48,6.98 92.48,12.64 | M3.1 92.48,12.64 | IMU_BLOCK2.2 80.28,5.26 85.47,10.45 I2C1P.2 85.5,10.64 85.5,12.19 85.94,12.64 92.48,12.64
SDA
  Top 0.305: MASTER.SDA M3.2 89.94,16.13 88.01,14.2 I2C1P.3 | MASTER.SDAU M1.9 27.46,10.67 U$4.SDA | IMU_MASTER.1 86.77,3.81 86.77,3.75 78.51,3.75 77.11,5.14 IMU_BLOCK2.1
  Bottom 0.305: IMU_MASTER.1 88.27,5.31 88.27,10.36 I2C1P.3 | U$4.SDA 28.98,9.14 28.98,8.83 32.73,5.08 76.94,5.08 IMU_BLOCK2.1
TX0
  Top 0.305: MASTER.TX0 M2.2 67.08,10.67 U$4.TX0
TX1  (via drill 0.36)
  Top 0.305: MASTER.TX1 M3.4 | v122.33,26.92 122.33,26.99 122.07,27.24 116.61,27.24 115.85,26.48 115.85,23.11 114.64,21.91 102.39,21.91 101.37,20.89 v100.1,20.89
  Bottom 0.305: v122.33,26.92 124.87,26.92 127.09,29.15 127.09,35.18 131.53,39.62 136.17,39.62 S_COMM.1 | MASTER.TX1 84.86,21.59 85.56,20.89 v100.1,20.89
TX2  (via drill 0.55 pad 0.7)
  Top 0.305: MASTER.TX2 M3.6 | v16.79,52.58 19.84,55.63 v26.7,55.63
  Bottom 0.305: M3.6 79.73,16.26 77.19,13.72 21.87,13.72 16.79,18.8 v16.79,52.58 | v26.7,55.63 26.7,66.4 13.85,79.25 SABER1.3
TX3
  Top 0.305: MASTER.TX3 M3.8 74.7,9.46 73.43,8.19 51.52,8.19 50.37,9.35 50.37,25.98 32.79,43.56 32.79,68.4 12.73,88.47 SABER2.3
U1
  Bottom 0.305: ULN.12 130.84,23.75 129.06,21.97 129.06,16.53 129.76,15.84 129.76,12.27 130.62,11.4 | ULN2.1 186.7,8.45 180.57,8.45 176.5,4.38 139.41,4.38 138.2,5.59 138.2,9.46 136.26,11.4 132.41,11.4 130.62,11.4 | 130.62,11.4 129.76,11.4 127.76,11.4 D10.K
U2
  Top 0.305: 130.38,15.72 128.47,15.72 D9.K | 130.38,15.72 131.65,16.99 131.65,22.02 133.38,23.75 ULN.13 | ULN2.2 192.02,8.1 185.76,1.84 134.58,1.84 133.12,3.3 133.12,10.41 130.99,12.55 130.99,15.24 130.51,15.72 130.38,15.72
U3
  Top 0.305: 133.76,16.69 134.14,17.07 134.14,21.97 135.92,23.75 ULN.14 | 133.76,16.69 D8.K | 133.76,16.69 133.76,4.83 134.84,3.75 177.05,3.75 179.43,6.12 179.43,9.14 180.06,9.78 193.38,9.78 194.96,8.2 ULN2.3
U4  (via drill 0.35)
  Top 0.305: ULN.15 138.46,23.57 v136.73,21.84 | ULN1.1 203.71,8.2 203.66,8.25 200.24,8.25 198.08,10.41 179.1,10.41 178.59,9.91 178.59,6.44 176.53,4.38 140.17,4.38 138.2,6.35 138.2,13.91 D7.K
  Bottom 0.305: v136.73,21.84 136.72,21.83 136.72,15.37 D7.K
U5
  Top 0.305: ULN.16 141.07,23.88 D6.K 141.2,15.49 175.54,15.49 179.35,11.68 203.8,11.68 207.48,8 208.84,8 ULN1.2
VCC  (via drill 0.35, 0.55)
  Top 0.305: v122.01,92.65 121.75,92.39 121.75,89.19 LM358.8 | v122.01,96.77 122.01,109.94 121.67,110.29
  Top 1.27: ULN.9 122.07,22.81 122.07,9.27 122.1,9.25 v122.1,1.85
  Top 2.54: 244.63,91.87 U$3.IN+ | 51.38,99.54 P2.3 | 232.49,7.87 ULN_SUPPLY1.2
  Top 3.81: SUPPLY.1 244.63,91.87 | P1.3 35.15,101.78 37.39,104.01 46.91,104.01 51.38,99.54 | ULN_SUPPLY.1 ULN_SUPPLY.2 ULN_SUPPLY1.1 ULN_SUPPLY1.2 | 232.49,7.87 251.51,7.87 259.18,15.54 259.18,60.1 244.45,74.83 U$3.IN+ 244.45,101.9 243.87,102.49 | 243.87,102.49 201.14,102.49 P4.3 196.32,100.96 195.07,102.21 184.38,102.21 P3.3 179.91,103 172.62,110.29 121.67,110.29 56.34,110.29 51.38,105.33 P2.3 | 243.87,102.49 VCC-GND.1
  Bottom 0.305: v122.01,96.77 v122.01,92.65
  Bottom 1.27: v122.1,1.85 212.19,1.85 215.65,5.31 ULN_SUPPLY.1
VIN  (via drill 0.36)
  Top 1.016: U$4.VIN 51.84,58.93 MASTER.VIN M7.8 52.16,80.58 52.16,84.71 57.24,89.79 75.34,89.79 75.34,103.44 79.08,107.19 107.42,107.19 SERVO.2 119.94,94.67 134.91,94.67 138.84,90.74 157.04,90.74 163.09,84.68 | S7.8 SLAVE.VIN 209.83,34.1 211.54,35.81 v211.54,48.2 | 163.09,84.68 197.49,84.68 197.49,84.96 204.57,92.05 U$3.OUT+ | 163.09,84.68 163.11,84.66 U2.3
  Bottom 1.016: v211.54,48.2 211.54,85.6 205.09,92.05 U$3.OUT+
VREF
  Top 0.305: M7.2 MASTER.IOREF 36.6,58.93 U$4.VREF

## Text on the board
bPlace: GND | GND | GND | GND
tNames: VCC | VCC | GND | VCC | GND | VCC | P1 | P2 | GND | GND | P3 | P4 | RRL | IN- | GND | VIN | PWM | OUT- | - | B | A | - | + | - | B | A | - | + | VCC | GND | RST | GND | GND | - | B1 | A1 | - | + | - | B1 | A1 | - | + | VCC | 5V | IMU_SL | IMU_SL | D6 | OUT+ | IN+ | + | - | C | D | + | - | C | D | TX3 | A8 | A9 | GND | GND | GND | P4 | VIN | GND | 5V | D4 | P3 | RST | S-RST | GND | TX2 | 3V3 | 5V | A0 | A1 | A2 | A3 | A4 | A5 | A6 | A7 | A8 | A9 | A10 | A11 | A12 | A13 | A14 | A15 | S-SCL | S-SDA | S-RX1 | S-TX1 | S-RX2 | S-TX2 | S-RX3 | S-TX3 | S-RX0 | S-TX0 | S-D2 | S-D3 | S-D4 | S-D5 | S-D6 | S-D7 | S-D8 | S-D9 | S-D10 | S-D11 | S-D12 | S-D13 | GND | S-ARF | S-SDA | S-SCL | RST | GND | GND | VIN | P2 | IOREF | 5V | 5V | S-D23 | P1 | 22 | 24 | S-D25 | GND | GD | 26 | S-D27 | D53 | D52 | S-D29 | D51 | 28 | D50 | 5V | S-D31 | 30 | D49 | D48 | S-D33 | D47 | 32 | D46 | 34 | S-D35 | D44 | D45 | S-D37 | 36 | D43 | D42 | S-D39 | S | 38 | M | D41 | D40 | SLAVE | S-D41 | 40 | D39 | D38 | 42 | S-D43 | D37 | D36 | S-D45 | 44 | D35 | D34 | 46 | S-D47 | D33 | D32 | S-D49 | 48 | D31 | D30 | T1 | R1 | BUZ1 | 50 | S-D51 | BUZ2 | D29 | D28 | 52 | S-D53 | MASTER | D27 | D26 | GND | GND | D25 | D24 | D23 | D22 | 5V | 5V | S-A15 | S-A14 | S-A13 | S-A12 | S-A11 | S-A10 | S-A9 | S-A8 | S-A7 | S-A6 | S-A5 | S-A4 | S-A3 | S-A2 | S-A1 | S-A0 | VIN | GND | GND | 5V | 3V3 | S-RST | SCL | SDA | AREF | GND | D13 | D12 | D11 | D10 | D9 | D8 | D7 | D6 | D5 | D4 | D3 | D2 | TX0 | RX0 | TX3 | RX3 | TX2 | RX2 | TX1 | RX1 | SDA | SCL | GND | L1 | L2 | 5V | MISO | GND | DR1 | MOSI | SCK | I2C | RST | CS4 | CS3 | CS2 | CS1 | GND | 5V | GND | DR2 | DR3 | GND | 5V | 5VA | SDA | SCL | U1 | U2 | U3 | U4 | U5 | VCC | VCC | VCC | VCC | SDA | SCL | GND
bNames: ROBOTICS RESEARCH LAB | D25 | D24 | PROX1 | PROX2 | S-D24 | PROX3 | S-D25 | PROX4